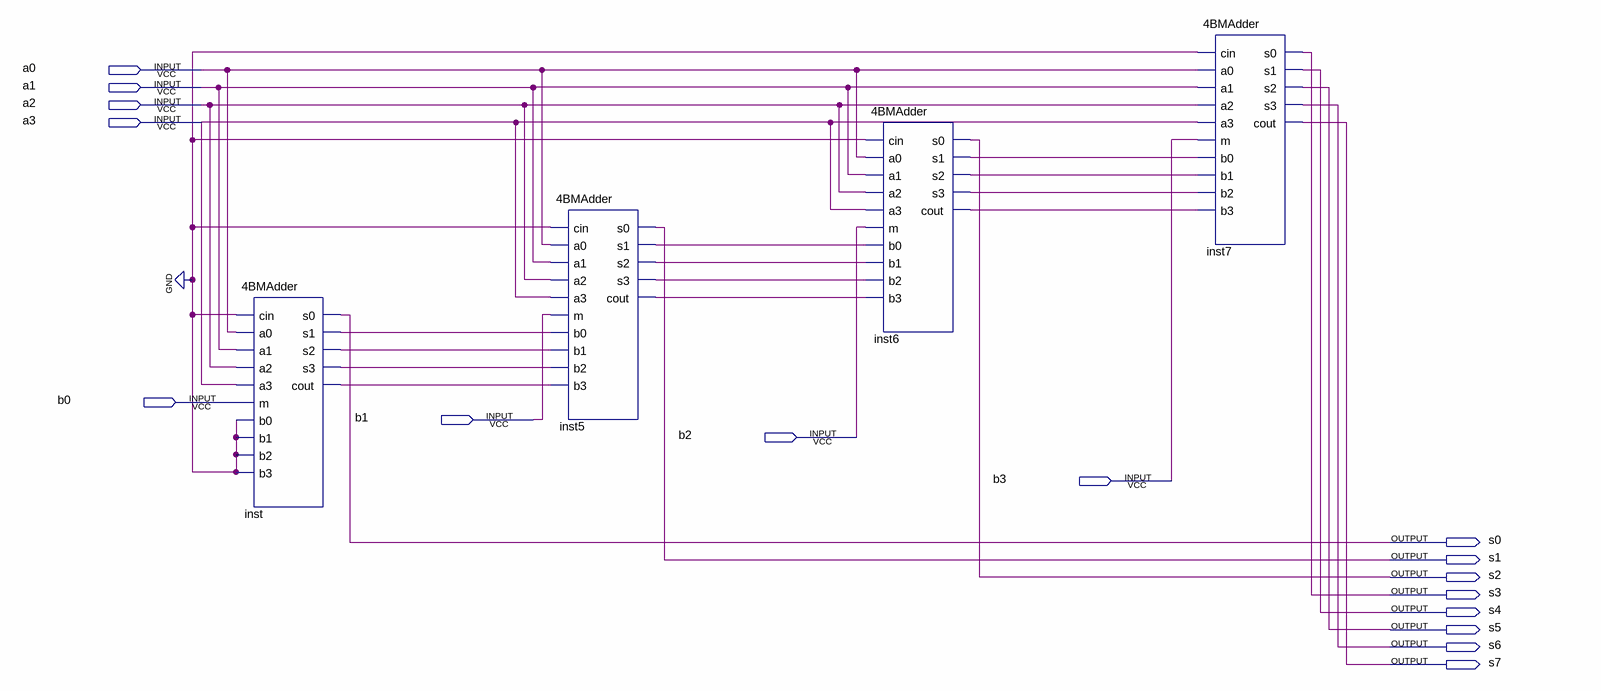
[diagram p0: schematic sheet]
// Quartus schematic 4BMult.bdf as structural Verilog: 4 symbols, 16 pins
module \4BMult  (
  input  a0,
  input  a1,
  input  a2,
  input  a3,
  input  b0,
  input  b1,
  input  b2,
  input  b3,
  output s0,
  output s1,
  output s2,
  output s3,
  output s4,
  output s5,
  output s6,
  output s7
);

  wire inst5_cout, inst5_s1, inst5_s2, inst5_s3, inst6_cout, inst6_s1, inst6_s2, inst6_s3, inst_cout,
       inst_s1, inst_s2, inst_s3;

  \4BMAdder  inst (
    .cin(1'b0), .a0(a0), .a1(a1), .a2(a2), .a3(a3), .m(b0), .b0(1'b0), .b1(1'b0), .b2(1'b0), .b3(1'b0),
    .s0(s0), .s1(inst_s1), .s2(inst_s2), .s3(inst_s3), .cout(inst_cout));
  \4BMAdder  inst5 (
    .cin(1'b0), .a0(a0), .a1(a1), .a2(a2), .a3(a3), .m(b1), .b0(inst_s1), .b1(inst_s2), .b2(inst_s3),
    .b3(inst_cout), .s0(s1), .s1(inst5_s1), .s2(inst5_s2), .s3(inst5_s3), .cout(inst5_cout));
  \4BMAdder  inst6 (
    .cin(1'b0), .a0(a0), .a1(a1), .a2(a2), .a3(a3), .m(b2), .b0(inst5_s1), .b1(inst5_s2), .b2(inst5_s3),
    .b3(inst5_cout), .s0(s2), .s1(inst6_s1), .s2(inst6_s2), .s3(inst6_s3), .cout(inst6_cout));
  \4BMAdder  inst7 (
    .cin(1'b0), .a0(a0), .a1(a1), .a2(a2), .a3(a3), .m(b3), .b0(inst6_s1), .b1(inst6_s2), .b2(inst6_s3),
    .b3(inst6_cout), .s0(s3), .s1(s4), .s2(s5), .s3(s6), .cout(s7));
endmodule
